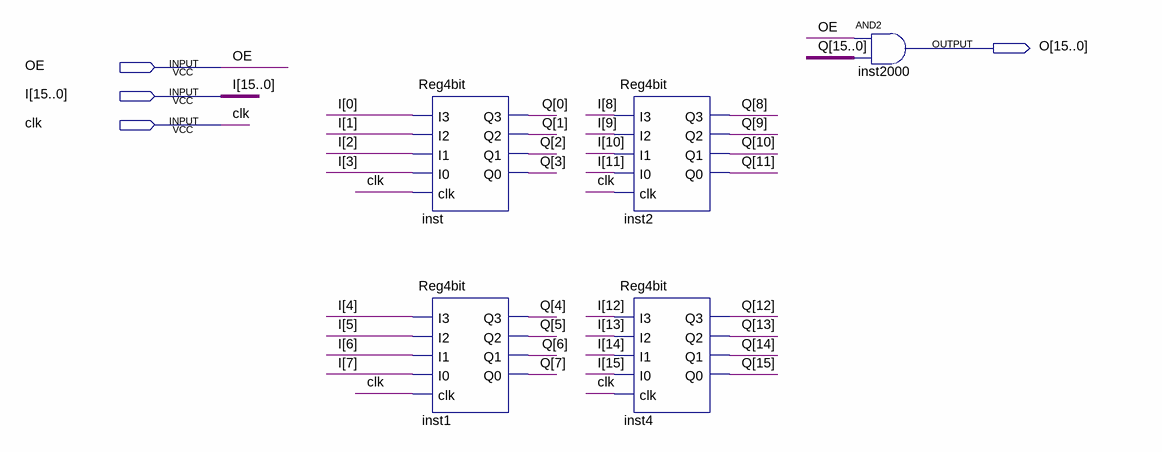
[diagram p0: schematic sheet]
// Quartus schematic reg16.bdf as structural Verilog: 5 symbols, 4 pins
module reg16 (
  input  OE,
  input  [15:0] I,
  input  clk,
  output [15:0] O
);

  wire [15:0] Q;

  Reg4bit inst (.I3(I[0]), .I2(I[1]), .I1(I[2]), .I0(I[3]), .clk(clk), .Q3(Q[0]), .Q2(Q[1]), .Q1(Q[2]), .Q0(Q[3]));
  Reg4bit inst1 (.I3(I[4]), .I2(I[5]), .I1(I[6]), .I0(I[7]), .clk(clk), .Q3(Q[4]), .Q2(Q[5]), .Q1(Q[6]), .Q0(Q[7]));
  Reg4bit inst2 (.I3(I[8]), .I2(I[9]), .I1(I[10]), .I0(I[11]), .clk(clk), .Q3(Q[8]), .Q2(Q[9]), .Q1(Q[10]), .Q0(Q[11]));
  Reg4bit inst4 (
    .I3(I[12]), .I2(I[13]), .I1(I[14]), .I0(I[15]), .clk(clk), .Q3(Q[12]), .Q2(Q[13]), .Q1(Q[14]), .Q0(Q[15]));
  assign O = {16{OE}} & Q;  // AND2 inst2000, 16 bits wide
endmodule
